# Altium schematic sheet Task_Schematic.SchDoc
size A2; SheetNumber: 1; SheetTotal: 1
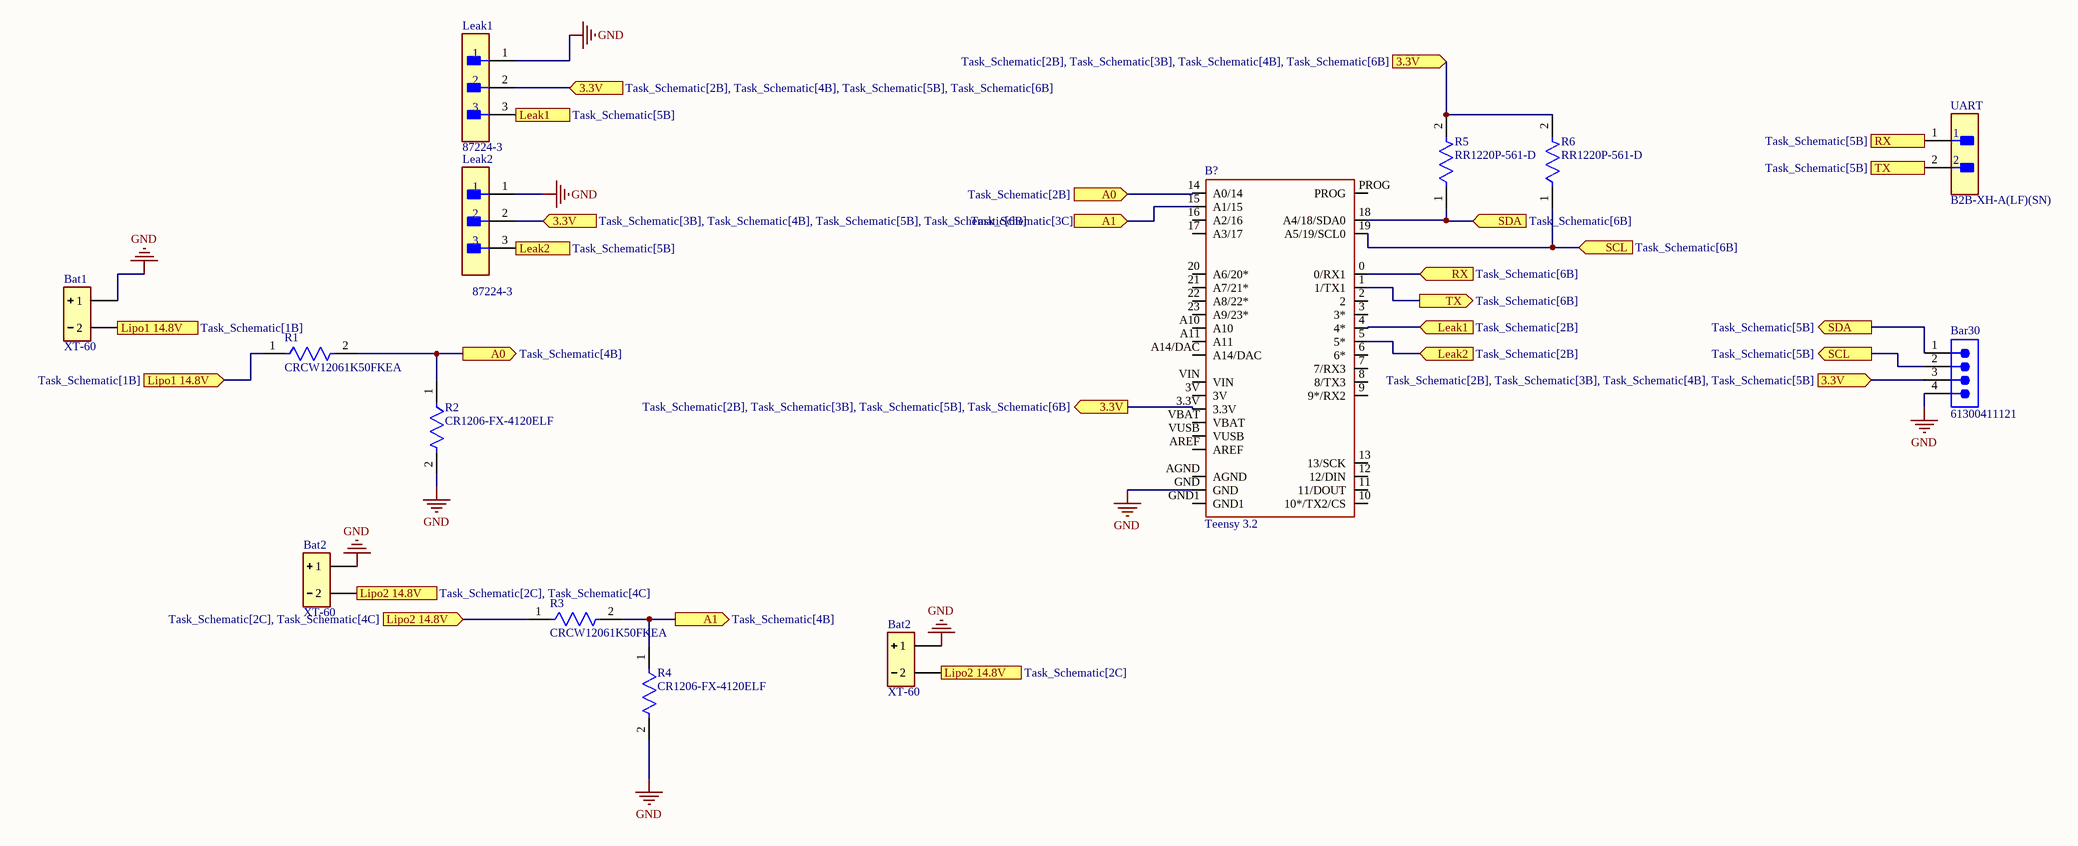
[diagram p0: Task_Schematic.SchDoc]

## Parts
(Parts that share a designator on the sheet are numbered #1, #2 ... from top to bottom, then left to right.)
B?  Teensy 3.2  [Teensy 3.2-Footprint-1]
Bar30  61300411121  [61300411121]
Bat1  XT-60  [PRT-10474-Footprint-1]
Bat2#1  XT-60  [PRT-10474-Footprint-1]
Bat2#2  XT-60  [PRT-10474-Footprint-1]
Leak1  87224-3  [FP-87224-3-MFG]
Leak2  87224-3  [FP-87224-3-MFG]
R1  CRCW12061K50FKEA  [FP-CRCW1206-e3-IPC_C]
R2  CR1206-FX-4120ELF  [FP-CR1206-IPC_C]
R3  CRCW12061K50FKEA  [FP-CRCW1206-e3-IPC_C]
R4  CR1206-FX-4120ELF  [FP-CR1206-IPC_C]
R5  RR1220P-561-D  [FP-RR1220-IPC_C]
R6  RR1220P-561-D  [FP-RR1220-IPC_C]
UART  B2B-XH-A(LF)(SN)  [FP-B2B-XH-A_LF_SN-MFG]

## Ports
3.3V (in, see Task_Schematic[2B], Task_Schematic[3B], Task_Schematic[4B], Task_Schematic[5B]), 3.3V (in, see Task_Schematic[2B], Task_Schematic[3B], Task_Schematic[4B], Task_Schematic[6B]), 3.3V (in, see Task_Schematic[2B], Task_Schematic[4B], Task_Schematic[5B], Task_Schematic[6B]), 3.3V (in, see Task_Schematic[3B], Task_Schematic[4B], Task_Schematic[5B], Task_Schematic[6B]), 3.3V (out, see Task_Schematic[2B], Task_Schematic[3B], Task_Schematic[5B], Task_Schematic[6B]), A0 (in, see Task_Schematic[2B]), A0 (out, see Task_Schematic[4B]), A1 (in, see Task_Schematic[3C]), A1 (out, see Task_Schematic[4B]), Leak1 (in, see Task_Schematic[2B]), Leak1 (out, see Task_Schematic[5B]), Leak2 (in, see Task_Schematic[2B]), Leak2 (out, see Task_Schematic[5B]), Lipo1 14.8V (in, see Task_Schematic[1B]), Lipo1 14.8V (see Task_Schematic[1B]), Lipo2 14.8V (in, see Task_Schematic[2C]), Lipo2 14.8V (in, see Task_Schematic[2C], Task_Schematic[4C]), RX (in, see Task_Schematic[6B]), RX (out, see Task_Schematic[5B]), SCL (in, see Task_Schematic[6B]), SCL (out, see Task_Schematic[5B]), SDA (in, see Task_Schematic[6B]), SDA (out, see Task_Schematic[5B]), TX (in, see Task_Schematic[5B]), TX (out, see Task_Schematic[6B])

## Nets
GND: B?.GND Bar30.4 Bat1.1 Bat2#1.1 Bat2#2.1 Leak1.1 Leak2.1 R2.2 R4.2
3.3V: B?.3.3V Bar30.3 Leak1.2 Leak2.2 R5.2 R6.2 ; port 3.3V
A0: B?.14(A0/14) R1.2 R2.1 ; port A0
A1: B?.15(A1/15) R3.2 R4.1 ; port A1
Leak1: B?.4(4*) Leak1.3 ; port Leak1
Leak2: B?.5(5*) Leak2.3 ; port Leak2
Lipo1 14.8V: Bat1.2 R1.1 ; port Lipo1 14.8V
Lipo2 14.8V: Bat2#1.2 Bat2#2.2 R3.1 ; port Lipo2 14.8V
RX: B?.0(0/RX1) UART.1 ; port RX
SCL: B?.19(A5/19/SCL0) Bar30.2 R6.1 ; port SCL
SDA: B?.18(A4/18/SDA0) Bar30.1 R5.1 ; port SDA
TX: B?.1(1/TX1) UART.2 ; port TX

Not connected (* = marked no-connect by the designer): B? 2 3(3*) 3V 6(6*) 7(7/RX3) 8(8/TX3) 9(9*/RX2) 10(10*/TX2/CS) 11(11/DOUT) 12(12/DIN) 13(13/SCK) 16(A2/16) 17(A3/17) 20(A6/20*) 21(A7/21*) 22(A8/22*) 23(A9/23*) A10 A11 A14/DAC AGND AREF GND1 PROG VBAT VIN VUSB

## Library data of the parts
B? = CMP-00000-2: Teensy 3.2 K20 Eval Board; Evaluation Kit: Yes; Core Architecture: ARM; Series: Kinetis
Bar30 = CMP-1502-01064-2: NexarPartId: 32855522; Pitch: 2.54mm; Number of Contacts: 4; Contact Resistance: 20mΩ; Gender: Male; Current Rating: 3A; Connector Type: Male Pin; Voltage Rating: 250V; Lead Free: Lead Free; Contact Plating: Gold; Max Operating Temperature: 105°C; Packaging: Bulk; Height: 8.89mm; Orientation: Vertical; Contact Mating Length: 5.9944mm; Contact Material: Copper; Lead Pitch: 2.54mm; Min Operating Temperature: -40°C; Termination: Solder; Color: Black; Number of Rows: 1; REACH SVHC: Unknown; RoHS: Compliant; Mount: Through Hole; Number of Positions: 4; Number of Pins: 4; Operating Supply Voltage: 250V
Bat1 Bat2#1 Bat2#2 = CMP-002-00071-2: XT60 female Connectors; pins: 2
Leak1 Leak2 = CMP-2000-05697-2: CONN HEADER VERT 3POS 2.54MM; Number of Positions: 3; Gasket: No (Without); High Speed Serial Data Connector: No; Current Rating: 3A; Contact Post Length: 0.125inch; PCB Thickness: 1.397mm; PCB Mount Retention: Without; Connector Type: Plug; Approvals: CSA; PCB Mounting Orientation: Vertical; Pitch: 2.54mm; Mating Alignment: No (Without); Housing Color: Black; Contact Gender: Male; Length: 7.21mm; Max Operating Temperature: 105°C; Strain Relief: No (Without); Contact Material: Bronze; Row Spacing: 2.54mm; Series: AMPMODU MOD II; Board Standoff: No (Without); Package Quantity: 520; Radiation Hardening: No; Contact Protection: No (Without); Stabilizers: No (Without); Number of Rows: 1; Contact Mating Length: 8.08mm; Contact Shape: Square; Depth: 2.54mm; Contact Current Rating: 3A; Flammability Rating: UL94 V-0; Packaging: Carton; Number of Contacts: 3; Orientation: Straight; Mount: Through Hole; Keyed: No; Contact Type: Male Pin; Housing Material: Thermoplastic; High Temperature Housing: No; ELV: Compliant; Contact Plating: Gold; Termination: Through Hole; Selectively Loaded: No (Without); Lead Free: Lead Free; Min Operating Temperature: -65°C; Mating Connector Lock: No (Without); Color: Black; RoHS Compliant: Yes
R1 R3 = CMP-02407-002229-1: RES Thick Film, 1.5kΩ, 1%, 0.25W, 100ppm/°C, 1206; Voltage Rating (DC): 200V; Power Rating: 250mW; Resistance: 1.5kR; Depth: 1.6mm; Case/Package: 1206; Packaging: Tape and Reel; Military Standard: Not; Radiation Hardening: No; Features: Automotive AEC-Q200; Number of Terminations: 2; Case Code (Imperial): 1206; Width: 0.063inch; Voltage Rating: 200V; Tolerance: 1%; Max Operating Temperature: 155°C; Weight: 0.000353oz; Package Quantity: 10; Temperature Coefficient: 100ppm/°C; Lead Free: Lead Free; Height: 0.024inch; Max Power Dissipation: 250mW; Termination: SMD/SMT; Length: 3.2mm; Contact Plating: Tin; Composition: Thick Film; Min Operating Temperature: -55°C; Case Code (Metric): 3216
R2 R4 = CMP-07231-004698-1: Thick Film Chip Resistors 1206 412Ω 0.25W 1% 100ppm/°C; Voltage Rating: 200V; Max Power Dissipation: 250mW; Resistance: 412R; Case/Package: 1206; Min Operating Temperature: -55°C; Package Quantity: 5000; Military Standard: Not; Height: 0.03inch; Tolerance: 1%; Radiation Hardening: No; Number of Terminations: 2; Width: 0.063inch; Length: 3.2mm; Case Code (Imperial): 1206; Packaging: Tape and Reel; Contact Plating: Tin; Mount: Surface Mount; Features: Moisture Resistant; Max Operating Temperature: 155°C; Power Rating: 250mW; Temperature Coefficient: 100ppm/°C; Termination: SMD/SMT; Composition: Thick Film; Thickness: 610um; Depth: 1.6mm; Case Code (Metric): 3216
R5 R6 = CMP-2001-03458-2: 560Ω ±0.5% 0.1W 1/10W Chip Resistor 0805 (2012 Metric) Thin Film; Max Power Dissipation: 100mW; Voltage Rating (DC): 100V; Resistance: 560R; Temperature Coefficient: 25ppm/°C; Height: 0.4mm; Number of Pins: 2; Case Code (Imperial): 0805; Lead Free: Lead Free; Max Operating Temperature: 125°C; Tolerance: 0.5%; Case/Package: 0805; Technology: THIN FILM; Series: RR; Voltage Rating: 100V; Mount: Surface Mount; Depth: 1.25mm; Number of Terminations: 2; Length: 2mm; Power Rating: 100mW; Package Quantity: 1; Size Code: 0805; Termination: SMD/SMT; Case Code (Metric): 2012; Width: 0.049inch; RoHS Compliant: Yes; Packaging: Tape and Reel; Min Operating Temperature: -55°C; Resistor Type: Thin Film
UART = CMP-2000-05888-3: CONN HEADER VERT 2POS 2.5MM; Current Rating: 3A; Voltage Rating: 250V; Number of Contacts: 2; Contact Resistance: 20mR; Wire/Cable Gauge: 22AWG; Insulation Resistance: 1GR; Connector Type: Male Pin; Packaging: Bulk; Contact Material: Brass; Lead Free: Lead Free; Orientation: Straight; Contact Plating: Tin; Max Current Rating: 3A; Termination: Solder; Fastening Type: Detent; Depth: 5.75mm; Housing Material: Polyamide; REACH SVHC: No SVHC; Series: XH; Voltage Rating (AC): 250V; Number of Positions: 2; Color: Natural; Contact Type: Male Pin; Max Voltage Rating (DC): 250V; Pitch: 2.5mm; Lead Pitch: 2.5mm; Mount: Through Hole; Max Operating Temperature: 85°C; Length: 7.4mm; Max Voltage Rating (AC): 250V; Min Operating Temperature: -25°C; Number of Rows: 1; Housing Color: White